# Altium schematic sheet PGA.SCHDOC
size B
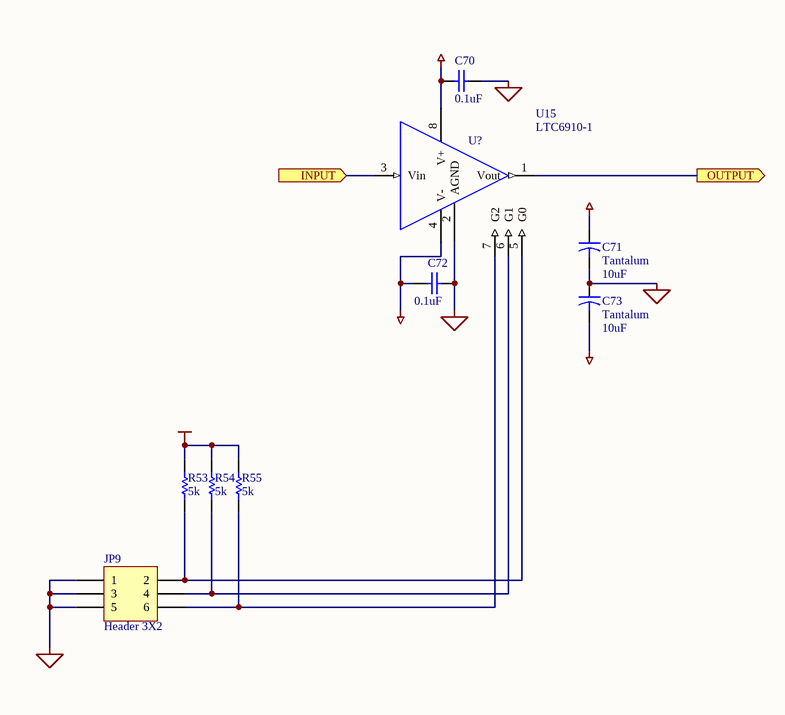
[diagram p0: PGA.SCHDOC]

## Parts
C70  value 0.1uF  [CC1608-0603]  (hidden comment: Cap)
C71  Tantalum  value 10uF  [TC3216-1206]
C72  value 0.1uF  [CC1608-0603]  (hidden comment: Cap)
C73  Tantalum  value 10uF  [TC3216-1206]
JP9  Header 3X2  [HDR2X3]
R53  value 5k  [CC2012-0805]  (hidden comment: Res1)
R54  value 5k  [CC2012-0805]  (hidden comment: Res1)
R55  value 5k  [CC2012-0805]  (hidden comment: Res1)
U15  LTC6910-1  [TSOT-23-8]

## Ports
INPUT (in), OUTPUT (out)

## Nets
AGND: C70.2 C71.2 C72.1 C73.1 JP9.1 JP9.3 JP9.5 U15.2(AGND)
AVDD: C70.1 C71.1 R53.2 R54.2 R55.2 U15.8(V+)
AVSS: C72.2 C73.2 U15.4(V-)
INPUT: U15.3(Vin) ; port INPUT
OUTPUT: U15.1(Vout) ; port OUTPUT
NetJP9_2: JP9.2 R53.1 U15.5(G0)
NetJP9_4: JP9.4 R54.1 U15.6(G1)
NetJP9_6: JP9.6 R55.1 U15.7(G2)

## Notes on the sheet
- (in symbol LTC6910-2) U?

## Library data of the parts
C70 C72 = Cap: Capacitor; Manufacturer: Generic Components; Class I: Passive; Published: 8-Jun-2000; Revision: July-2002: Re-released for DXP Platform.; Publisher: Altium Limited; Class II: Capacitor
C71 C73 = Cap2: Capacitor; Manufacturer: Generic Components; Class I: Passive; Published: 23-Sep-2002; Publisher: Altium Limited; Class II: Capacitor
JP9 = Header 3X2: Header, 3-Pin, Dual row; Manufacturer: Generic Components; Class I: Connector; Revision: July-2002: Re-released for DXP Platform.; Publisher: Altium Limited
R53-R55 = Res1: Resistor; Manufacturer: Generic Components; Class I: Passive; Published: 8-Jun-2000; Revision: July-2002: Re-released for DXP Platform.; Publisher: Altium Limited; Class II: Resistor
U15 = LTC6910-2: LTI Digitally Controlled Programmabe Gain Amp